# Altium schematic sheet OffBoardConn.SchDoc
size A4; SheetNumber: 4; SheetTotal: 4
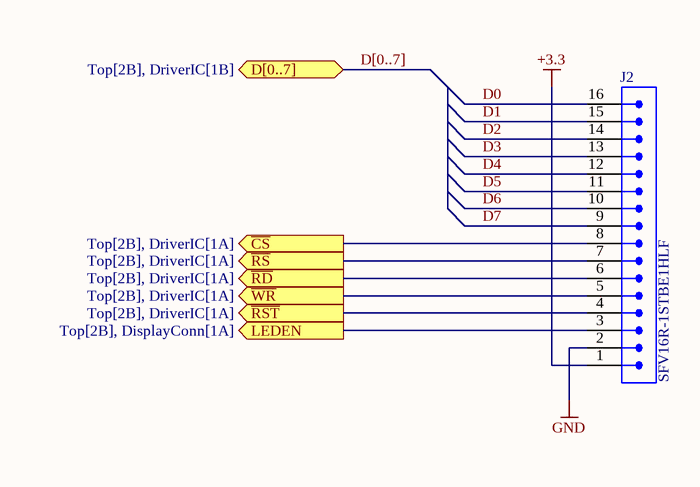
[diagram p0: OffBoardConn.SchDoc]

## Parts
J2  SFV16R-1STBE1HLF  [FFC16POS]

## Ports
D[0..7] (bidir, see Top[2B], DriverIC[1B]), LEDEN (out, see Top[2B], DisplayConn[1A]), ~{CS} (out, see Top[2B], DriverIC[1A]), ~{RD} (out, see Top[2B], DriverIC[1A]), ~{RST} (out, see Top[2B], DriverIC[1A]), ~{RS} (out, see Top[2B], DriverIC[1A]), ~{WR} (out, see Top[2B], DriverIC[1A])

## Nets
+3.3: J2.1
GND: J2.2
~{CS}: J2.8 ; port ~{CS}
D0: J2.16
D1: J2.15
D2: J2.14
D3: J2.13
D4: J2.12
D5: J2.11
D6: J2.10
D7: J2.9
LEDEN: J2.3 ; port LEDEN
~{RD}: J2.6 ; port ~{RD}
~{RS}: J2.7 ; port ~{RS}
~{RST}: J2.4 ; port ~{RST}
~{WR}: J2.5 ; port ~{WR}

## Buses and harness runs
bus D[0..7] = port D[0..7]

## Library data of the parts
J2 = SFV16R-1STBE1HLF: 16 Position FFC, FPC Connector Contacts, Bottom 0.020" (0.50mm) Surface Mount, Right Angle